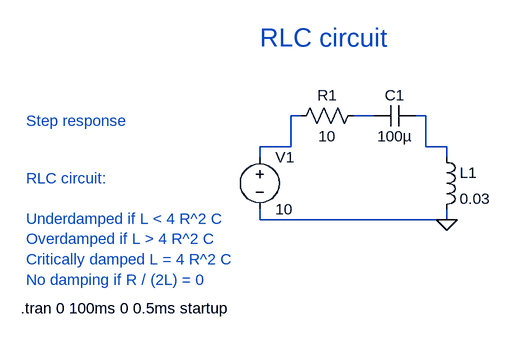
[diagram p0: schematic RLC-step-response-example.asc]
RLC-step-response-example.asc, the LTspice schematic file:
Version 4.1
SHEET 1 900 680
WIRE 352 192 352 208
WIRE 64 192 64 208
WIRE 352 208 64 208
FLAG 352 208 0
WIRE 128 48 112 48
WIRE 64 112 64 96
WIRE 112 48 112 96
WIRE 112 96 64 96
WIRE 240 48 224 48
WIRE 208 48 224 48
WIRE 304 48 320 48
WIRE 352 112 352 96
WIRE 320 48 320 96
WIRE 320 96 352 96
SYMBOL voltage 64 96 R0
WINDOW 123 0 0 Left 2
WINDOW 39 0 0 Left 2
SYMATTR InstName V1
SYMATTR Value 10
SYMBOL ind 336 96 R0
SYMATTR InstName L1
SYMATTR Value 0.03
SYMBOL res 112 64 R270
WINDOW 0 32 56 VTop 2
WINDOW 3 0 56 VBottom 2
SYMATTR InstName R1
SYMATTR Value 10
SYMBOL cap 240 64 R270
WINDOW 0 32 32 VTop 2
WINDOW 3 0 32 VBottom 2
SYMATTR InstName C1
SYMATTR Value 100µ
TEXT -304 344 Left 2 !.tran 0 100ms 0 0.5ms startup
TEXT -296 144 Left 2 ;RLC circuit:\n \nUnderdamped if L < 4 R^2 C\nOverdamped if L > 4 R^2 C\nCritically damped L = 4 R^2 C\nNo damping if R / (2L) = 0
TEXT -296 56 Left 2 ;Step response
TEXT 64 -72 Left 4 ;RLC circuit

The netlist it stands for:
* RLC-step-response-example.asc
V1 N001 0 10
L1 N003 0 0.03
R1 N001 N002 10
C1 N002 N003 100µ
.tran 0 100ms 0 0.5ms startup
* RLC circuit:
* Underdamped if L < 4 R^2 C
* Overdamped if L > 4 R^2 C
* Critically damped L = 4 R^2 C
* No damping if R / (2L) = 0
* Step response
* RLC circuit
.backanno
.end